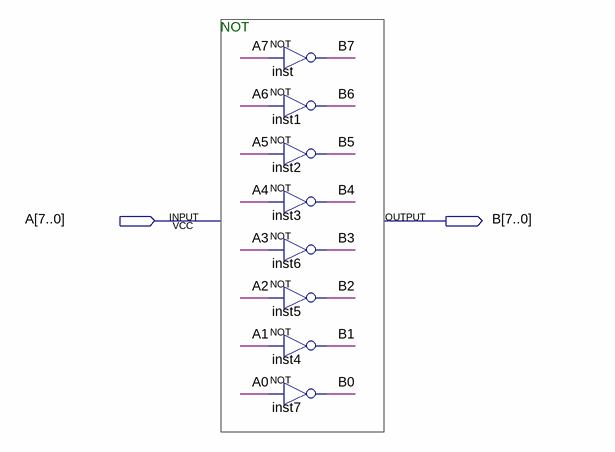
[diagram p0: schematic sheet]
// Quartus schematic EightBitNot.bdf as structural Verilog: 8 symbols, 2 pins
module EightBitNot (
  input  [7:0] A,
  output [7:0] B
);

  not inst (B[7], A[7]);
  not inst1 (B[6], A[6]);
  not inst2 (B[5], A[5]);
  not inst3 (B[4], A[4]);
  not inst6 (B[3], A[3]);
  not inst5 (B[2], A[2]);
  not inst4 (B[1], A[1]);
  not inst7 (B[0], A[0]);

  // Notes on the sheet:
  //   NOT 
endmodule
